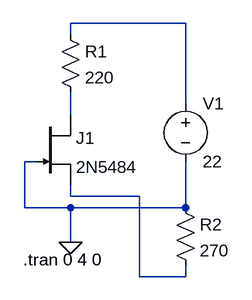
[diagram p0: schematic Draft12.asc]
Draft12.asc, the LTspice schematic file:
Version 4
SHEET 1 880 680
WIRE 384 48 224 48
WIRE 224 64 224 48
WIRE 384 160 384 48
WIRE 224 176 224 144
WIRE 176 240 160 240
WIRE 224 288 224 272
WIRE 320 288 224 288
WIRE 160 304 160 240
WIRE 224 304 160 304
WIRE 384 304 384 240
WIRE 384 304 224 304
WIRE 224 352 224 304
WIRE 320 400 320 288
WIRE 384 400 384 384
WIRE 384 400 320 400
FLAG 224 352 0
SYMBOL njf 176 176 R0
SYMATTR InstName J1
SYMATTR Value 2N5484
SYMBOL res 208 48 R0
SYMATTR InstName R1
SYMATTR Value 220
SYMBOL voltage 384 144 R0
WINDOW 123 0 0 Left 2
WINDOW 39 0 0 Left 2
SYMATTR InstName V1
SYMATTR Value 22
SYMBOL res 368 288 R0
SYMATTR InstName R2
SYMATTR Value 270
TEXT 158 376 Left 2 !.tran 0 4 0

The netlist it stands for:
* Draft12.asc
J1 N002 0 N003 2N5484
R1 N001 N002 220
V1 N001 0 22
R2 0 N003 270
.model NJF NJF
.model PJF PJF
.lib standard.jft
.tran 0 4 0
.backanno
.end